# Altium schematic sheet 70_MODULE_INTERFACE.SchDoc
size A; SheetNumber: 8; SheetTotal: 8
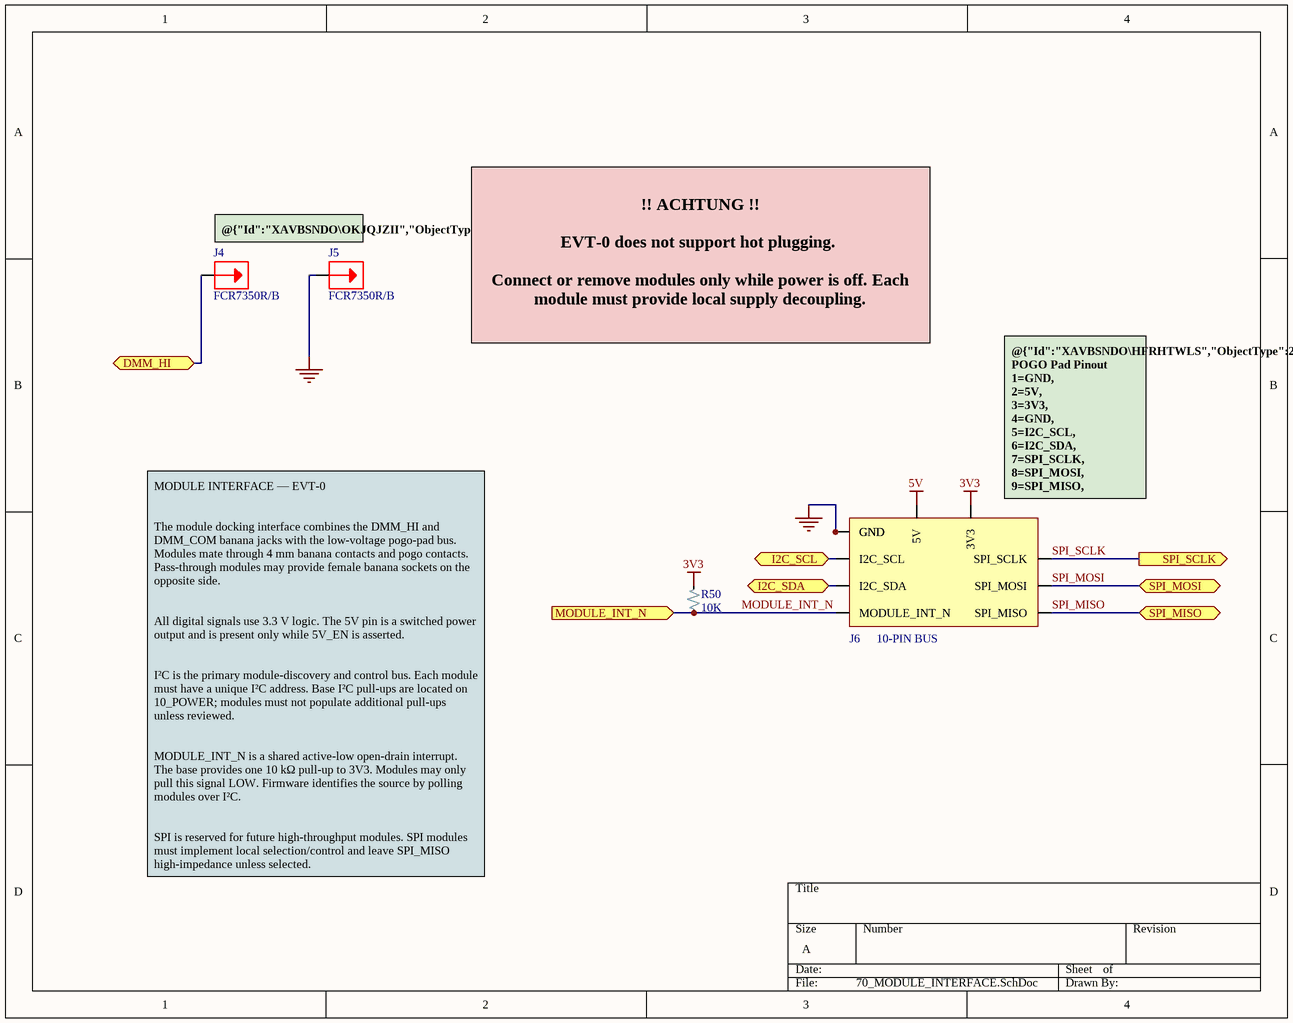
[diagram p0: 70_MODULE_INTERFACE.SchDoc]

## Parts
J4  FCR7350R/B  [FCR7350_S16-PC]
J5  FCR7350R/B  [FCR7350_S16-PC]
J6  10-PIN BUS  [MODULE_BUS_10_TAB_SLOT]
R50  10K  [R0805]

## Ports
DMM_HI (bidir, see 00_SYSTEM_TOP[1C], 40_INPUT_ROUTING[1B]), I2C_SCL (bidir, see 00_SYSTEM_TOP[2B], 10_POWER[3C], 20_MCU_BLE[1B]), I2C_SDA (bidir, see 00_SYSTEM_TOP[2B], 10_POWER[3C], 20_MCU_BLE[1C]), MODULE_INT_N (in, see 00_SYSTEM_TOP[2B], 20_MCU_BLE[1B]), SPI_MISO (bidir, see 00_SYSTEM_TOP[2C], 20_MCU_BLE[1B], 30_ADC[4C]), SPI_MOSI (bidir, see 00_SYSTEM_TOP[2C], 20_MCU_BLE[1B], 30_ADC[4C]), SPI_SCLK (out, see 00_SYSTEM_TOP[2C], 20_MCU_BLE[1B], 30_ADC[4C])

## Nets
3V3: J6.3(3V3) R50.2
5V: J6.2(5V)
GND: J5.1(IN) J6.1(GND) J6.4(GND)
DMM_HI: J4.1(IN) ; port DMM_HI
I2C_SCL: J6.5(I2C_SCL) ; port I2C_SCL
I2C_SDA: J6.6(I2C_SDA) ; port I2C_SDA
MODULE_INT_N: J6.10(MODULE_INT_N) R50.1 ; port MODULE_INT_N
SPI_MISO: J6.9(SPI_MISO) ; port SPI_MISO
SPI_MOSI: J6.8(SPI_MOSI) ; port SPI_MOSI
SPI_SCLK: J6.7(SPI_SCLK) ; port SPI_SCLK

## Notes on the sheet
- @{"Id":"XAVBSNDO\OKJQJZII","ObjectType":2}   DMM Probes   @{"Id":"XAVBSNDO\EBBIREGQ","ObjectType":2}
- !! ACHTUNG !!
  EVT-0 does not support hot plugging.
  Connect or remove modules only while power is off. Each module must provide local supply decoupling.
- (near J6) @{"Id":"XAVBSNDO\HFRHTWLS","ObjectType":2} POGO Pad Pinout
  1=GND,
  2=5V,
  3=3V3,
  4=GND,
  5=I2C_SCL,
  6=I2C_SDA,
  7=SPI_SCLK,
  8=SPI_MOSI,
  9=SPI_MISO,
  10=MODULE_INT_N
- MODULE INTERFACE — EVT-0
  The module docking interface combines the DMM_HI and DMM_COM banana jacks with the low-voltage pogo-pad bus. Modules mate through 4 mm banana contacts and pogo contacts. Pass-through modules may provide female banana sockets on the opposite side.
  All digital signals use 3.3 V logic. The 5V pin is a switched power output and is present only while 5V_EN is asserted.
  I²C is the primary module-discovery and control bus. Each module must have a unique I²C address. Base I²C pull-ups are located on 10_POWER; modules must not populate additional pull-ups unless reviewed.
  MODULE_INT_N is a shared active-low open-drain interrupt. The base provides one 10 kΩ pull-up to 3V3. Modules may only pull this signal LOW. Firmware identifies the source by polling modules over I²C.
  SPI is reserved for future high-throughput modules. SPI modules must implement local selection/control and leave SPI_MISO high-impedance unless selected.

## Library data of the parts
J4 J5 = FCR7350: 4 mm shrouded banana socket, PCB mount; Manufacturer: Cliff; Current Rating: 24A; Gender: Receptacle; Voltage Rating: 1kV; Supplier: DigiKey; Supplier Part Number: 4654-FCR7350R-ND; Manufacturer Part Number: FCR7350R; RoHS: Compliant; Category: Connectors; Stock: 10020; Pricing: 1=7.66, 10=6.509, 25=6.1016, 50=5.8102, 100=5.5327, 300=5.12017, 500=4.93902, 1000=4.70352 (USD); Color: Red; Connector Type: Socket; Contact Material: Gold; Contact Plating: Gold; Height: 10.922mm; Insulation Material: PVC; Lifecycle Status: Production; Mounting Technology: Through Hole; REACH SVHC: Yes; Termination: Through Hole; Voltage Rating (DC): 1kV; Weight: 4.535924g; Width: 11.938mm; ComponentLink1URL: https://datasheet.octopart.com:443/FCR7350R-Cliff-datasheet-67476090.pdf?src-supplier=IHS; ComponentLink1Description: https://datasheet.octopart.com:443/FCR7350R-Cliff-datasheet-67476090.pdf?src-supplier=IHS; ComponentLink2URL: https://datasheet.octopart.com:443/FCR7350R-Cliff-datasheet-10025950.pdf?src-supplier=element14+APAC; ComponentLink2Description: https://datasheet.octopart.com:443/FCR7350R-Cliff-datasheet-10025950.pdf?src-supplier=element14+APAC; ComponentLink3URL: https://datasheet.octopart.com:443/FCR7350R-Cliff-datasheet-188862624.pdf?src-supplier=TME; ComponentLink3Description: https://datasheet.octopart.com:443/FCR7350R-Cliff-datasheet-188862624.pdf?src-supplier=TME; ComponentLink4URL: https://datasheet.octopart.com:443/FCR7350R-Cliff-datasheet-10027538.pdf?src-supplier=Farnell; ComponentLink4Description: https://datasheet.octopart.com:443/FCR7350R-Cliff-datasheet-10027538.pdf?src-supplier=Farnell
J6 = J_MODULE_BUS: 10-pin stackable module interface for power, I2C, SPI, and shared interrupt
R50 = R_0805: RES 1/8W 0805; Manufacturer: Stackpole Electronics; Manufacturer Part Number: RNCF0805TKY10K0; Manufacturer Package Identifier: 0805 (2012 metric); Max Power Dissipation: 125mW; Value: 10kΩ; Temperature Coefficient: 5ppm/°C; Tolerance: 0.01%; Working Voltage: 150V; Supplier: DigiKey; Supplier Part Number: RNCF0805TKY10K0CT-ND; RoHS: Compliant; Category: Chip SMD Resistors; Stock: 4649; Pricing: 1=1.61, 10=1.334, 50=1.1716, 100=1.1105, 500=0.99044, 1000=0.94751, 2000=0.90945, 3000=0.8893, 5000=0.86599, 7000=0.85183, 10000=0.8378 (USD); Case/Package: 0805; Case Code (Imperial): 0805; Case Code (Metric): 2012; Composition: Thin Film; Country of Origin: Taiwan; Export Control Classification Number (ECCN) Code: EAR99; Features: Moisture Resistant; Height: 550µm; Harmonized Tariff Schedule (HTS) Code: 8533.21.00.30; Introduction Date: 2011-06-03; Lead Free: Lead Free; Length: 2mm; Lifecycle Status: Production; Max Operating Temperature: 155°C; Min Operating Temperature: -55°C; Mounting Technology: Surface Mount; Number of Terminals: 2; Number of Terminations: 2; Packaging: Tape & Reel (TR); Power Rating: 125mW; Ratings: AEC-Q200; REACH SVHC: Yes; Schedule B: 8533210045, 8533210045|8533210045|8533210045|8533210045|8533210045; Width: 1.25mm; ComponentLink1URL: https://datasheet.octopart.com:443/RNCF0805TKY10K0-Stackpole-Electronics-datasheet-182148124.pdf?src-supplier=IHS; ComponentLink1Description: https://datasheet.octopart.com:443/RNCF0805TKY10K0-Stackpole-Electronics-datasheet-182148124.pdf?src-supplier=IHS; ComponentLink2URL: https://datasheet.octopart.com:443/RNCF0805TKY10K0-Stackpole-Electronics-datasheet-12511394.pdf?src-supplier=Factory+Futures; ComponentLink2Description: https://datasheet.octopart.com:443/RNCF0805TKY10K0-Stackpole-Electronics-datasheet-12511394.pdf?src-supplier=Factory+Futures; ComponentLink3URL: https://datasheet.octopart.com:443/RNCF0805TKY10K0-Stackpole-Electronics-datasheet-141158876.pdf?src-supplier=Stackpole+Electronics; ComponentLink3Description: https://datasheet.octopart.com:443/RNCF0805TKY10K0-Stackpole-Electronics-datasheet-141158876.pdf?src-supplier=Stackpole+Electronics; ComponentLink4URL: https://datasheet.octopart.com:443/RNCF0805TKY10K0-Stackpole-Electronics-datasheet-28504821.pdf?src-supplier=Master+Electronics; ComponentLink4Description: https://datasheet.octopart.com:443/RNCF0805TKY10K0-Stackpole-Electronics-datasheet-28504821.pdf?src-supplier=Master+Electronics; ComponentLink5URL: https://datasheet.octopart.com/RNCF0805TKY10K0-Stackpole-Electronics-datasheet-11755897.pdf; ComponentLink5Description: https://datasheet.octopart.com/RNCF0805TKY10K0-Stackpole-Electronics-datasheet-11755897.pdf; ComponentLink6URL: http://sigma.octopart.com:80/15941409/materials_sheet/Stackpole-Electronics-RNCF0805TKY10K0.pdf?src-supplier=Compliance+Statements; ComponentLink6Description: http://sigma.octopart.com:80/15941409/materials_sheet/Stackpole-Electronics-RNCF0805TKY10K0.pdf?src-supplier=Compliance+Statements; ComponentLink7URL: http://sigma.octopart.com:80/141158212/rohs_statement/Stackpole-Electronics-RNCF0805TKY10K0.pdf?src-supplier=Compliance+Statements; ComponentLink7Description: http://sigma.octopart.com:80/141158212/rohs_statement/Stackpole-Electronics-RNCF0805TKY10K0.pdf?src-supplier=Compliance+Statements; ComponentLink8URL: http://sigma.octopart.com:80/141158211/reach_statement/Stackpole-Electronics-RNCF0805TKY10K0.pdf?src-supplier=Compliance+Statements; ComponentLink8Description: http://sigma.octopart.com:80/141158211/reach_statement/Stackpole-Electronics-RNCF0805TKY10K0.pdf?src-supplier=Compliance+Statements